# Altium project pcb3dar.PrjPcb
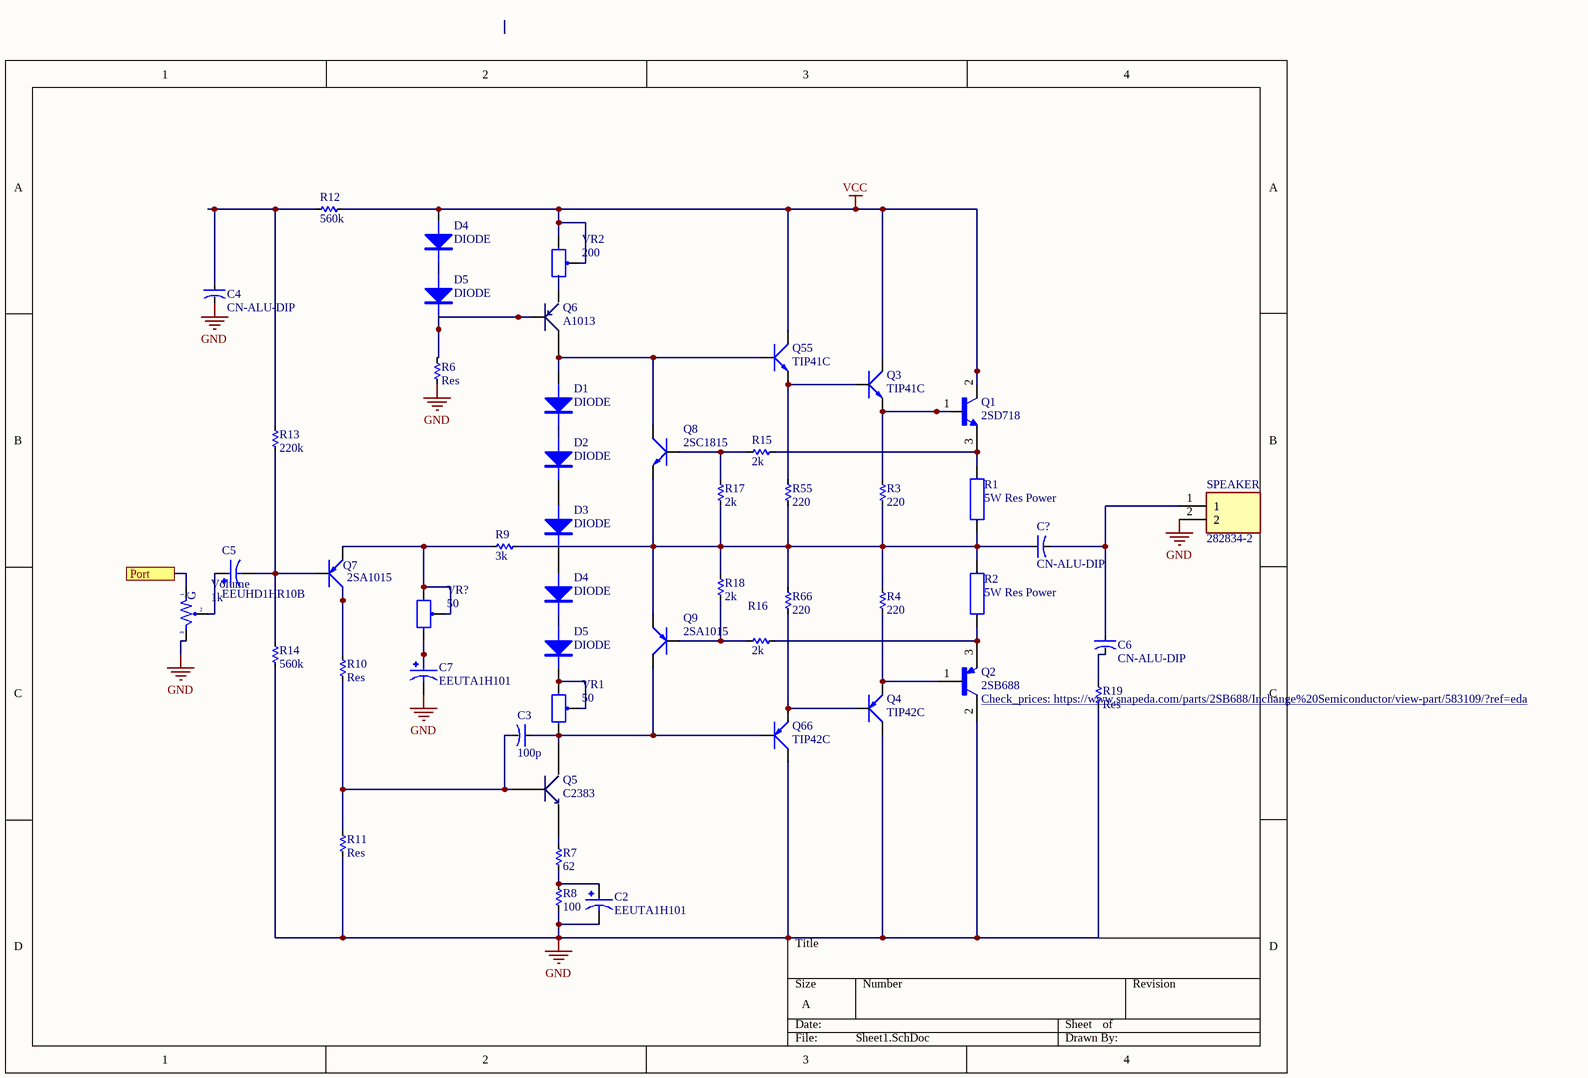
[diagram p0: Sheet1.SchDoc]
1 sheet, 50 parts. Net scope: flat (ports and power ports of the same name join across sheets).
Board file: PCB2.PcbDoc

## Sheet Sheet1.SchDoc
size A; SheetNumber: 1; SheetTotal: 1

### Parts
(Parts that share a designator on the sheet are numbered #1, #2 ... from top to bottom, then left to right.)
C1  CN-ALU-DIP  [CA-ALU-30]
C2  EEUTA1H101  [CAPPRD500W60D1000H1250]
C3  100p  [CA-ALU-2.54]
C4  CN-ALU-DIP  [CA-ALU-2.54]
C5  EEUHD1HR10B  [CAPPRD500W50D500H1100]
C6  CN-ALU-DIP  [CA-ALU-2.54]
C7  EEUTA1H101  [CAPPRD500W60D1000H1250]
D1  DIODE  [diode]
D2  DIODE  [diode]
D3  DIODE  [diode]
D4#1  DIODE  [diode]
D4#2  DIODE  [diode]
D5#1  DIODE  [diode]
D5#2  DIODE  [diode]
Q1  2SD718  [TO546P1579X502X2688-3]
Q2  2SB688  [TO545P1560X450X2320-3]
Q3  TIP41C  [TO220-123]
Q4  TIP42C  [TO220-123]
Q5  C2383  [C2383]
Q6  A1013  [A1013]
Q7  2SA1015  [TO92-123]
Q8  2SC1815  [TO92-123]
Q9  2SA1015  [TO92-123]
Q55  TIP41C  [TO220-123]
Q66  TIP42C  [TO220-123]
R1  5W Res Power  [DIEN TRO 5W]
R2  5W Res Power  [DIEN TRO 5W]
R3  220  [RES-1/2W]
R4  220  [RES-1/2W]
R6  Res  [RES-1/2W]
R7  62  [RES-1/2W]
R8  100  [RES-1/2W]
R9  3k  [RES-1/2W]
R10  Res  [RES-1/2W]
R11  Res  [RES-1/2W]
R12  560k  [RES-1/2W]
R13  220k  [RES-1/2W]
R14  560k  [RES-1/2W]
R15  2k  [RES-1/2W]
R16  2k  [RES-1/2W]
R17  2k  [RES-1/2W]
R18  2k  [RES-1/2W]
R19  Res  [RES-1/2W]
R55  220  [RES-1/2W]
R66  220  [RES-1/2W]
SPEAKER  282834-2  [TE_282834-2]
Volume  1k  [VR-S1]
VR1  50  [RVAR10K]
VR2  200  [RVAR10K]
VR3  50  [RVAR10K]

### Ports
Port

### Nets
GND: C2.N C4.2 C7.N Q2.2(C) Q4.2(C) Q66.2(C) R6.2 R8.2 R11.2 R14.2 R19.2 SPEAKER.2 Volume.3
VCC: D4#1.1 Q1.2(C) Q3.2(C) Q55.2(C) R12.2 VR2.1 VR2.2
NetC1_1: C1.1 Q8.1(E) Q9.1(E) R1.1 R2.2 R3.2 R4.1 R9.2 R17.2 R18.1 R55.2 R66.1
NetC1_2: C1.2 C6.1 SPEAKER.1
NetC2_P: C2.P R7.2 R8.1
NetC3_1: C3.1 Q5.2(C) Q9.2(C) Q66.1(B) VR1.3
NetC3_2: C3.2 Q5.3(B) R10.2 R11.1
NetC4_1: C4.1 R12.1 R13.1
NetC5_N: C5.N Q7.3(B) R13.2 R14.1
NetC5_P: C5.P Volume.2
NetC6_2: C6.2 R19.1
NetC7_P: C7.P VR3.3
NetD1_1: D1.1 Q6.2(C) Q8.2(C) Q55.1(B)
NetD1_2: D1.2 D2.1
NetD2_2: D2.2 D3.1
NetD3_2: D3.2 D4#2.1
NetD4#1_2: D4#1.2 D5#1.1
NetD4#2_2: D4#2.2 D5#2.1
NetD5#1_2: D5#1.2 Q6.3(B) R6.1
NetD5#2_2: D5#2.2 VR1.1 VR1.2
NetQ1_1: Q1.1(B) Q3.3(E) R3.1
NetQ1_3: Q1.3(E) R1.2 R15.1
NetQ2_1: Q2.1(B) Q4.3(E) R4.2
NetQ2_3: Q2.3(E) R2.1 R16.1
NetQ3_1: Q3.1(B) Q55.3(E) R55.1
NetQ4_1: Q4.1(B) Q66.3(E) R66.2
NetQ5_1: Q5.1(E) R7.1
NetQ6_1: Q6.1(E) VR2.3
NetQ7_1: Q7.1(E) R9.1 VR3.1 VR3.2
NetQ7_2: Q7.2(C) R10.1
NetQ8_3: Q8.3(B) R15.2 R17.1
NetQ9_3: Q9.3(B) R16.2 R18.2
NetVolume_1: Volume.1 ; port Port

### Notes on the sheet
- (in symbol VR-S) G

### Library data of the parts
C1 C3 C4 C6 = CN-ALU-DIP: Capacitor (Semiconductor SIM Model); Value: 104
C2 C7 = EEUTA1H101: Cap Aluminum Lytic 100uF 50V 20% (10 X 12.5mm) Radial 5mm 555mA 2000h 125Â°C Automotive Bulk; MF: Panasonic; MP: EEUTA1H101; Package: RADIAL-2 Panasonic; SnapEDA_Link: https://www.snapeda.com/parts/EEUTA1H101/Panasonic/view-part/2305858/?ref=snap; Check_prices: https://www.snapeda.com/parts/EEUTA1H101/Panasonic/view-part/2305858/?ref=eda; Value: *; Digi-Key_Part_Number: 10-EEU-TA1H101BCT-ND
C5 = EEUHD1HR10B: CAP ALUM 0.1UF 20% 50V RADIAL; MF: Panasonic; Package: RADIAL-2 Panasonic; Value: *; Availability: In Stock; Check_prices: https://www.snapeda.com/parts/EEUHD1HR10B/Panasonic/view-part/5793058/?ref=eda; Price: None; SnapEDA_Link: https://www.snapeda.com/parts/EEUHD1HR10B/Panasonic/view-part/5793058/?ref=snap; MP: EEUHD1HR10B
Q1 = 2SD718: Position Header Spacer Connector; MF: Toshiba; Price: None; Check_prices: https://www.snapeda.com/parts/2SD718/Toshiba/view-part/?ref=eda; Value: *; MP: 2SD718; Availability: Not in stock; SnapEDA_Link: https://www.snapeda.com/parts/2SD718/Toshiba/view-part/?ref=snap; Package: None
Q2 = 2SB688: Bipolar Transistors - BJT Pb TO3PI PLS PLN-N,DISCON(01-12)/PHASE-OUT(05-07)/OBSOLETE(07-10),; MF: Inchange Semiconductor; MP: 2SB688; Package: None; SnapEDA_Link: https://www.snapeda.com/parts/2SB688/Inchange%20Semiconductor/view-part/583109/?ref=snap; Availability: Unavailable; Value: *; Price: None; Check_prices: https://www.snapeda.com/parts/2SB688/Inchange%20Semiconductor/view-part/583109/?ref=eda
Q3 Q55 = TIP41C: NPN 2W, BCE; Value: TIP41C
Q4 Q66 = TIP42C: PNP 2W, BCE; Value: TIP42C
Q5 = TRAN C2383
Q7 Q9 = 2SA1015: PNP 600mW, ECB; Value: A1015
Q8 = 2SC1815: NPN 600mW, ECB; Value: C1815
R1 R2 = Res 5W: Creator: Nguyen Ba Bien
R3 R4 R6-R19 R55 R66 = Res: Manufacturer: Generic Components; Class: Passive; SubClass: R; Published: 08/06/2000; Publisher: Altium Hobart Technology Centre
SPEAKER = 282834-2: MF: {'manufacturer': u'TE Connectivity'}; Value: *; MP: 282834-2; Availability: Unavailable; Package: None; Price: None
Volume = VR-S: Var Resistor; Value: Volume 50k
VR1-VR3 = Var Resitor: Var Resistor; Value: VR 10K